# Altium schematic sheet 01_gap_interface.SchDoc: SENSEI Debug Board
size A1; Author: Sebastian Frey; DrawnBy: Sebastian Frey; Engineer: Sebastian Frey; Organization: Integrated System Laboratory; DocumentNumber: 1; Revision: v1.1; SheetNumber: 1; SheetTotal: 1
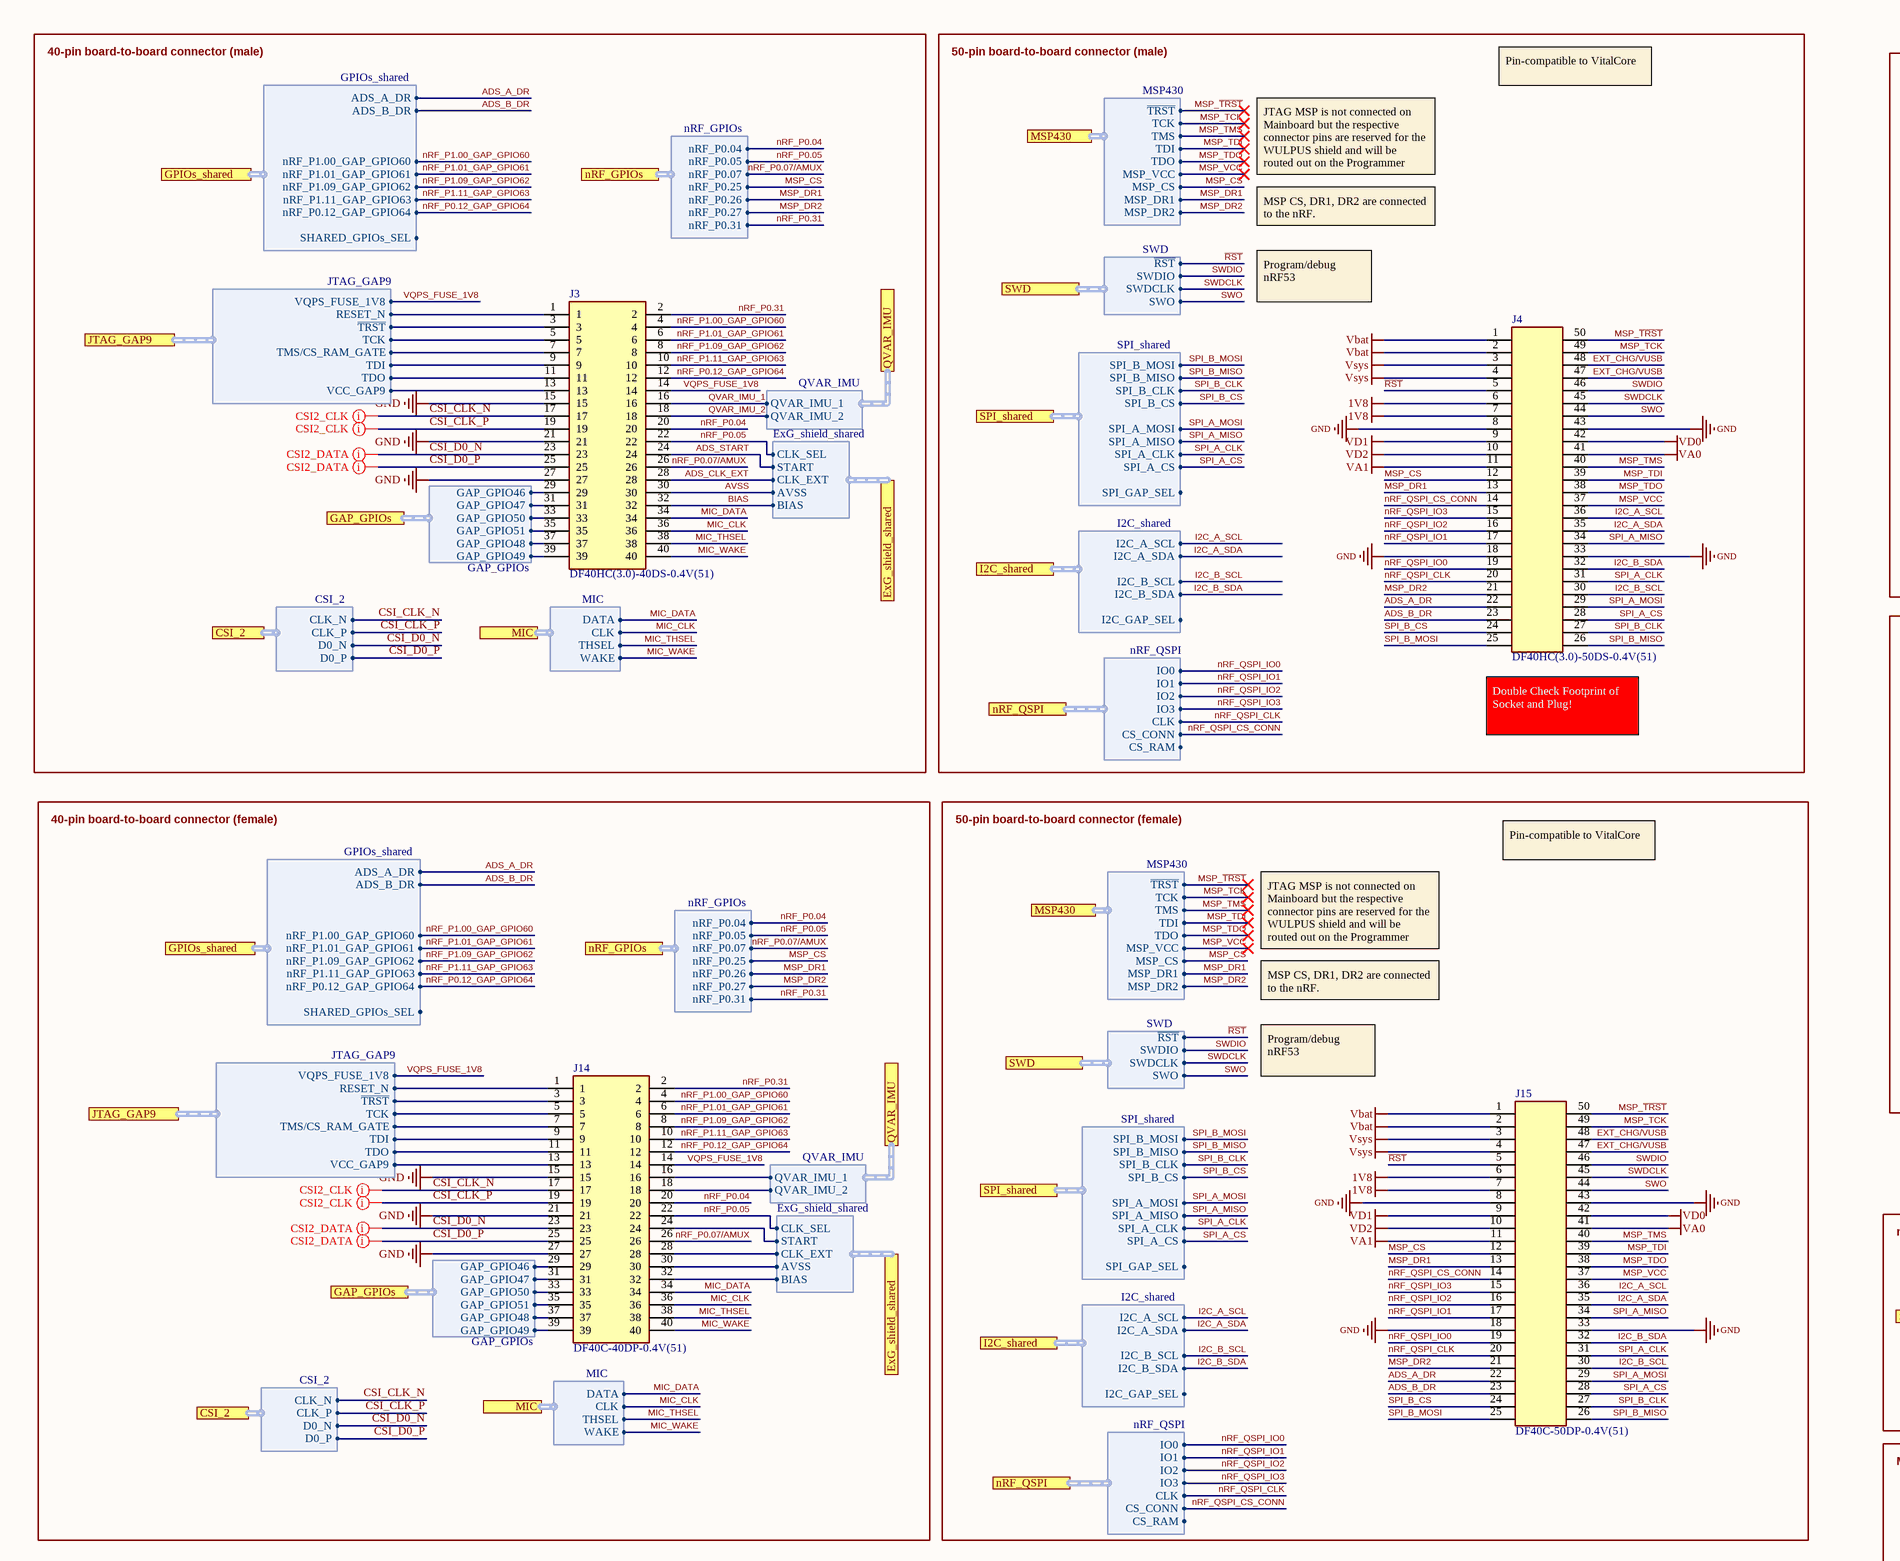
[diagram p0: 01_gap_interface.SchDoc, top left]
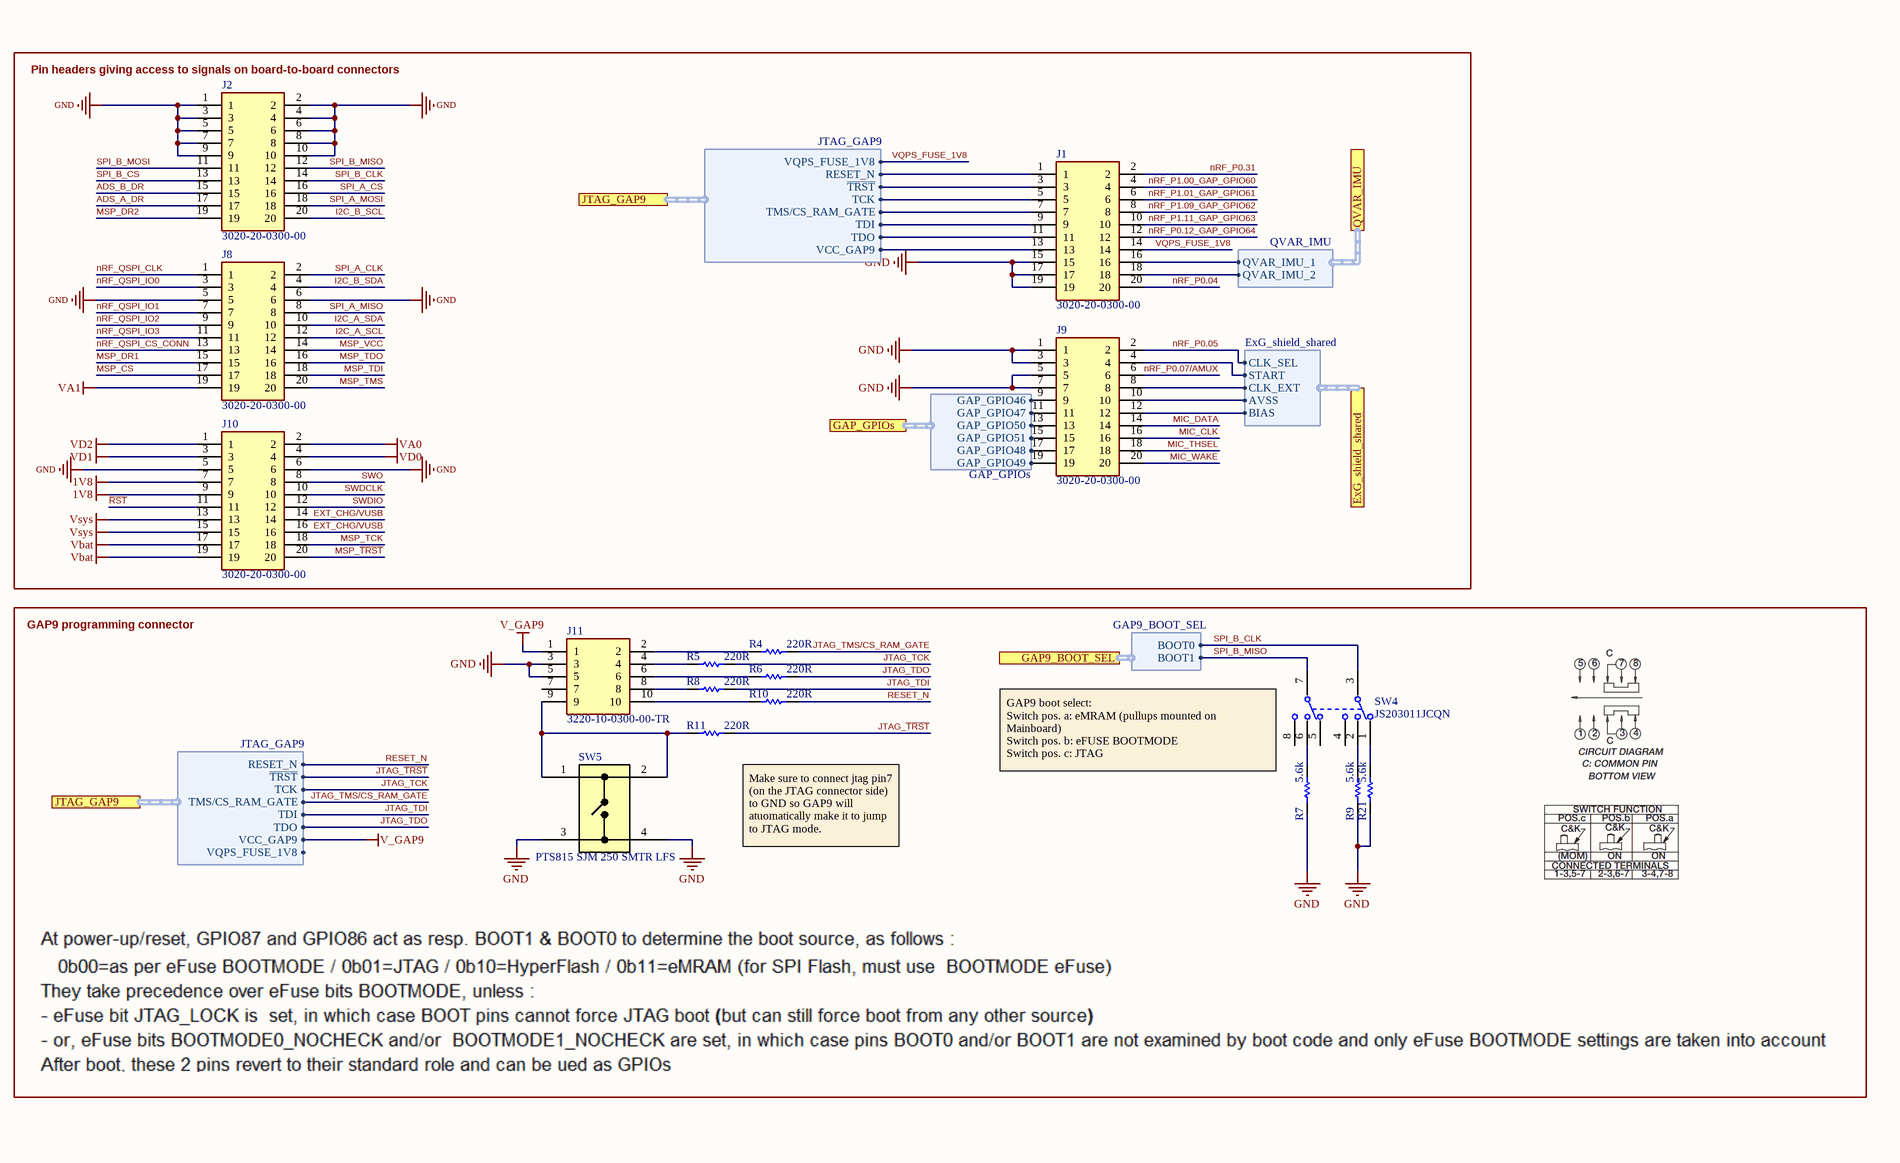
[diagram p1: 01_gap_interface.SchDoc, top right]
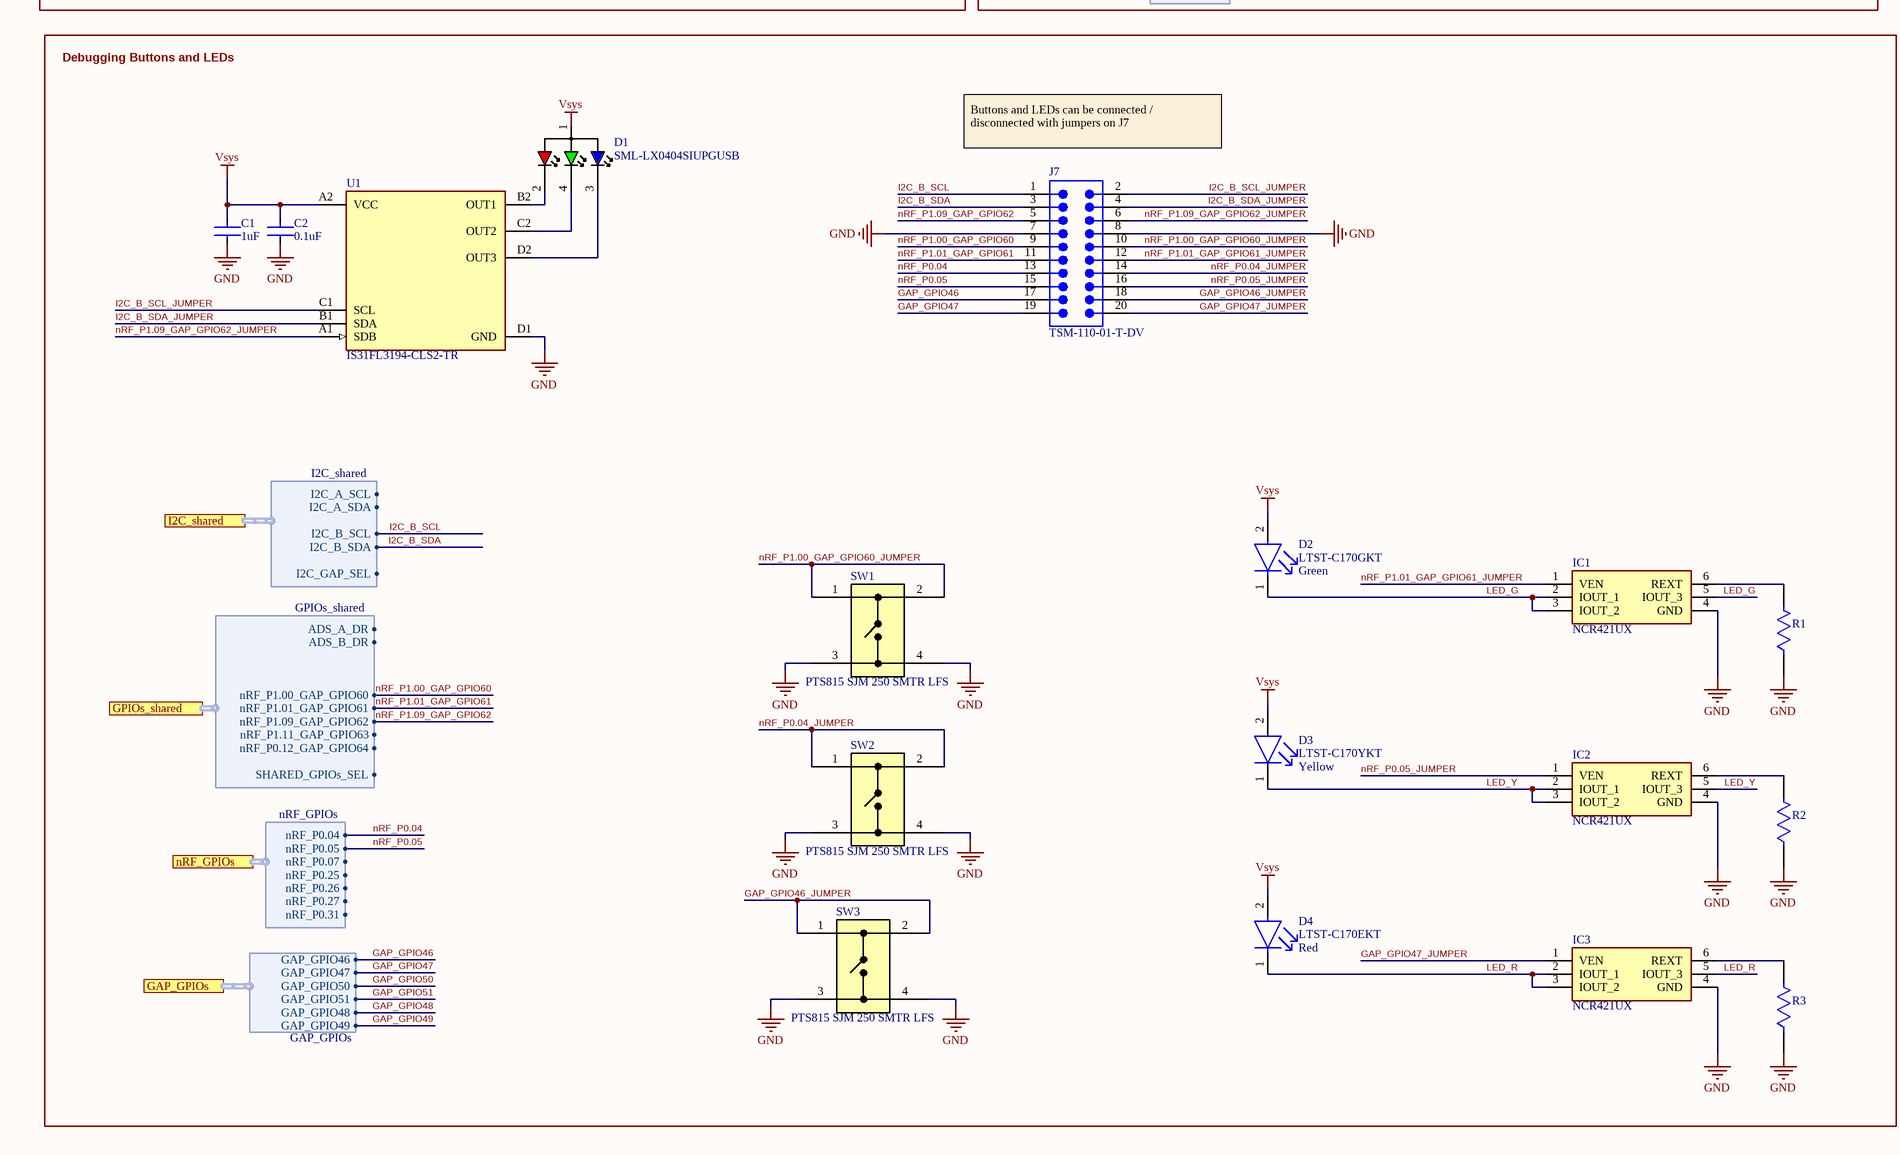
[diagram p2: 01_gap_interface.SchDoc, bottom left]
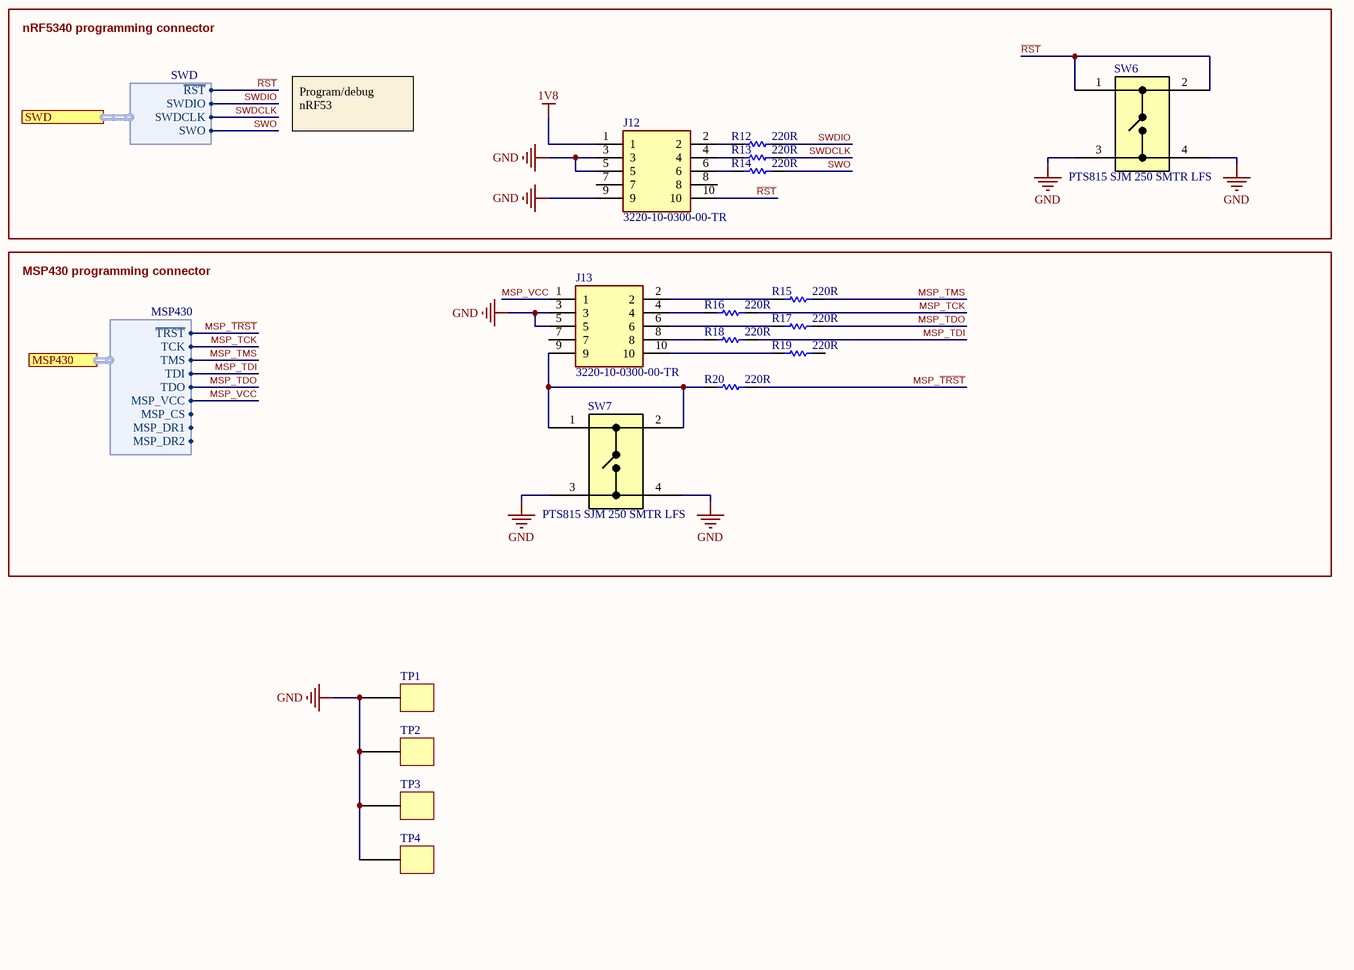
[diagram p3: 01_gap_interface.SchDoc, bottom right]

## Parts
C1  Capacitance: 1uF  [FP-CL511-IPC_C]  (hidden comment: CL05A105KP5NNNC)
C2  Capacitance: 0.1uF  [FP-CL278-IPC_C]  (hidden comment: CL05A104KA5NNNC)
D1  SML-LX0404SIUPGUSB  [SML-LX0404SIUPGUSB]
D2  LTST-C170GKT  Color: Green  [FP-LTST-C170GKT-MFG]
D3  LTST-C170YKT  Color: Yellow  [FP-LTST-C170YKT-MFG]
D4  LTST-C170EKT  Illumination Color: Red  [FP-LTST-C170AKT-MFG]
IC1  NCR421UX  [SOT95P275X110-6N]
IC2  NCR421UX  [SOT95P275X110-6N]
IC3  NCR421UX  [SOT95P275X110-6N]
J1  3020-20-0300-00  [302020030000]
J2  3020-20-0300-00  [302020030000]
J3  DF40HC(3.0)-40DS-0.4V(51)  [DF40HC3040DS04V51]
J4  DF40HC(3.0)-50DS-0.4V(51)  [DF40HC3050DS04V51]
J7  TSM-110-01-T-DV  [SMTC-TSM-110-01-X-DV]
J8  3020-20-0300-00  [302020030000]
J9  3020-20-0300-00  [302020030000]
J10  3020-20-0300-00  [302020030000]
J11  3220-10-0300-00-TR  [322010030000TR]
J12  3220-10-0300-00-TR  [322010030000TR]
J13  3220-10-0300-00-TR  [322010030000TR]
J14  DF40C-40DP-0.4V(51)  [FP-DF40C-40DP-0_4V_51-MFG]
J15  DF40C-50DP-0.4V(51)  [CONN_COMBI_50P]
R1  RR1220Q-680-D  [FP-RR1220-IPC_C]  (value not drawn)
R2  RR1220Q-680-D  [FP-RR1220-IPC_C]  (value not drawn)
R3  RR1220Q-680-D  [FP-RR1220-IPC_C]  (value not drawn)
R4  value 220R  [RESC0603X28X15ML05T05]  (hidden comment: CRCW0201220RFKED)
R5  value 220R  [RESC0603X28X15ML05T05]  (hidden comment: CRCW0201220RFKED)
R6  value 220R  [RESC0603X28X15ML05T05]  (hidden comment: CRCW0201220RFKED)
R7  Resistance: 5.6k  [RESC1608X55X30ML20T10]  (hidden comment: RK73B1JTTD562J)
R8  value 220R  [RESC0603X28X15ML05T05]  (hidden comment: CRCW0201220RFKED)
R9  Resistance: 5.6k  [RESC1608X55X30ML20T10]  (hidden comment: RK73B1JTTD562J)
R10  value 220R  [RESC0603X28X15ML05T05]  (hidden comment: CRCW0201220RFKED)
R11  value 220R  [RESC0603X28X15ML05T05]  (hidden comment: CRCW0201220RFKED)
R12  value 220R  [RESC0603X28X15ML05T05]  (hidden comment: CRCW0201220RFKED)
R13  value 220R  [RESC0603X28X15ML05T05]  (hidden comment: CRCW0201220RFKED)
R14  value 220R  [RESC0603X28X15ML05T05]  (hidden comment: CRCW0201220RFKED)
R15  value 220R  [RESC0603X28X15ML05T05]  (hidden comment: CRCW0201220RFKED)
R16  value 220R  [RESC0603X28X15ML05T05]  (hidden comment: CRCW0201220RFKED)
R17  value 220R  [RESC0603X28X15ML05T05]  (hidden comment: CRCW0201220RFKED)
R18  value 220R  [RESC0603X28X15ML05T05]  (hidden comment: CRCW0201220RFKED)
R19  value 220R  [RESC0603X28X15ML05T05]  (hidden comment: CRCW0201220RFKED)
R20  value 220R  [RESC0603X28X15ML05T05]  (hidden comment: CRCW0201220RFKED)
R21  Resistance: 5.6k  [RESC1608X55X30ML20T10]  (hidden comment: RK73B1JTTD562J)
SW1  PTS815 SJM 250 SMTR LFS  [SW4_PTS815 SJM 250 SMTR LFS_CNK]
SW2  PTS815 SJM 250 SMTR LFS  [SW4_PTS815 SJM 250 SMTR LFS_CNK]
SW3  PTS815 SJM 250 SMTR LFS  [SW4_PTS815 SJM 250 SMTR LFS_CNK]
SW4  JS203011JCQN  [FP-JS203011JCQN-MFG]
SW5  PTS815 SJM 250 SMTR LFS  [SW4_PTS815 SJM 250 SMTR LFS_CNK]
SW6  PTS815 SJM 250 SMTR LFS  [SW4_PTS815 SJM 250 SMTR LFS_CNK]
SW7  PTS815 SJM 250 SMTR LFS  [SW4_PTS815 SJM 250 SMTR LFS_CNK]
TP1  TP THT  [TEST_POINT_KEYSTONE_5007_TRAD]  (value not drawn)
TP2  TP THT  [TEST_POINT_KEYSTONE_5007_TRAD]  (value not drawn)
TP3  TP THT  [TEST_POINT_KEYSTONE_5007_TRAD]  (value not drawn)
TP4  TP THT  [TEST_POINT_KEYSTONE_5007_TRAD]  (value not drawn)
U1  IS31FL3194-CLS2-TR  [WLCSP_8_P0.4]

## Blocks framed on the sheet
40-pin board-to-board connector (male): J3
50-pin board-to-board connector (male): J4
GAP9 programming connector: J11 R4-R11 R21 SW4 SW5
40-pin board-to-board connector (female): J14
50-pin board-to-board connector (female): J15
nRF5340 programming connector: J12 R12-R14 SW6
MSP430 programming connector: J13 R15-R20 SW7
Debugging Buttons and LEDs: C1 C2 D1-D4 IC1-IC3 J7 R1-R3 SW1-SW3 U1

## Ports
CSI_2 (harness CSI_2), ExG_shield_shared (harness ExG_shield_shared), GAP9_BOOT_SEL (harness GAP9_BOOT_SEL), GAP_GPIOs (harness GAP_GPIOs), GPIOs_shared (harness GPIOs_shared), I2C_shared (harness I2C_shared), JTAG_GAP9 (harness JTAG_GAP9), MIC (harness MIC), MSP430 (harness MSP430), nRF_GPIOs (harness nRF_GPIOs), nRF_QSPI (harness nRF_QSPI), QVAR_IMU (harness QVAR_IMU), SPI_shared (harness SPI_shared), SWD (harness SWD)

## Harnesses
QVAR_IMU: QVAR_IMU_2, QVAR_IMU_1
MIC: DATA, THSEL, WAKE, CLK
GAP_GPIOs: GAP_GPIO46, GAP_GPIO47, GAP_GPIO50, GAP_GPIO51, GAP_GPIO48, GAP_GPIO49
GPIOs_shared: ADS_A_DR, ADS_B_DR, nRF_P1.00_GAP_GPIO60, nRF_P1.09_GAP_GPIO62, nRF_P1.11_GAP_GPIO63, nRF_P0.12_GAP_GPIO64, SHARED_GPIOs_SEL, nRF_P1.01_GAP_GPIO61
nRF_GPIOs: nRF_P0.07, nRF_P0.25, nRF_P0.05, nRF_P0.04, nRF_P0.26, nRF_P0.27, nRF_P0.31
CSI_2: CLK_N, CLK_P, D0_P, D0_N
JTAG_GAP9: ~{TRST}, TCK, TMS/CS_RAM_GATE, TDI, TDO, VCC_GAP9, RESET_N, VQPS_FUSE_1V8
SWD: ~{RST}, SWDIO, SWDCLK, SWO
nRF_QSPI: IO0, IO1, IO2, IO3, CLK, CS_CONN, CS_RAM
SPI_shared: SPI_B_MOSI, SPI_B_MISO, SPI_B_CLK, SPI_B_CS, SPI_A_MOSI, SPI_A_MISO, SPI_A_CLK, SPI_A_CS, SPI_GAP_SEL
I2C_shared: I2C_A_SCL, I2C_A_SDA, I2C_B_SCL, I2C_B_SDA, I2C_GAP_SEL
MSP430: ~{TRST}, TCK, TMS, TDI, TDO, MSP_VCC, MSP_DR1, MSP_DR2, MSP_CS
ExG_shield_shared: BIAS, AVSS, CLK_EXT, START, CLK_SEL
GAP9_BOOT_SEL: BOOT0, BOOT1

## Nets
1V8: J4.6 J4.7 J10.7 J10.9 J12.1 J15.6 J15.7
GND: C1.2 C2.2 IC1.4(GND) IC2.4(GND) IC3.4(GND) J1.15 J1.17 J1.19 J2.1 J2.2 J2.3 J2.4 J2.5 J2.6 J2.7 J2.8 J2.9 J2.10 J3.15 J3.21 J3.27 J4.8 J4.18 J4.33 J4.43 J7.7 J7.8 J8.5 J8.6 J9.1 J9.3 J9.5 J9.7 J10.5 J10.6 J11.3 J11.5 J12.3 J12.5 J12.9 J13.3 J13.5 J14.15 J14.21 J14.27 J15.8 J15.18 J15.33 J15.43 R1.1 R2.1 R3.1 R7.1 R9.1 R21.1 SW1.3 SW1.4 SW2.3 SW2.4 SW3.3 SW3.4 SW5.3 SW5.4 SW6.3 SW6.4 SW7.3 SW7.4 TP1.1(TP) TP2.1(TP) TP3.1(TP) TP4.1(TP) U1.D1(GND)
V_GAP9: J1.13 J3.13 J11.1 J14.13 ; port JTAG_GAP9.VCC_GAP9
VA0: J4.41 J10.2 J15.41
VA1: J4.11 J8.19 J15.11
Vbat: J4.1 J4.2 J10.17 J10.19 J15.1 J15.2
VD0: J4.42 J10.4 J15.42
VD1: J4.9 J10.3 J15.9
VD2: J4.10 J10.1 J15.10
Vsys: C1.1 C2.1 D1.1(Common_Anode) D2.2(A) D3.2(A) D4.2(A) J4.3 J4.4 J10.13 J10.15 J15.3 J15.4 U1.A2(VCC)
ADS_A_DR: J2.17 J4.22 J15.22 ; port GPIOs_shared.ADS_A_DR
ADS_B_DR: J2.15 J4.23 J15.23 ; port GPIOs_shared.ADS_B_DR
ADS_CLK_EXT: J3.28 J9.8 J14.28 ; port ExG_shield_shared.CLK_EXT
ADS_START: J3.24 J9.4 J14.24 ; port ExG_shield_shared.START
AVSS: J3.30 J9.10 J14.30 ; port ExG_shield_shared.AVSS
BIAS: J3.32 J9.12 J14.32 ; port ExG_shield_shared.BIAS
CSI_CLK_N: J3.17 J14.17 ; port CSI_2.CLK_N
CSI_CLK_P: J3.19 J14.19 ; port CSI_2.CLK_P
CSI_D0_N: J3.23 J14.23 ; port CSI_2.D0_N
CSI_D0_P: J3.25 J14.25 ; port CSI_2.D0_P
EXT_CHG/VUSB: J4.47 J4.48 J10.14 J10.16 J15.47 J15.48
GAP_GPIO46: J3.29 J7.17 J9.9 J14.29 ; port GAP_GPIOs.GAP_GPIO46
GAP_GPIO46_JUMPER: J7.18 SW3.1 SW3.2
GAP_GPIO47: J3.31 J7.19 J9.11 J14.31 ; port GAP_GPIOs.GAP_GPIO47
GAP_GPIO47_JUMPER: IC3.1(VEN) J7.20
GAP_GPIO48: J3.37 J9.17 J14.37 ; port GAP_GPIOs.GAP_GPIO48
GAP_GPIO49: J3.39 J9.19 J14.39 ; port GAP_GPIOs.GAP_GPIO49
GAP_GPIO50: J3.33 J9.13 J14.33 ; port GAP_GPIOs.GAP_GPIO50
GAP_GPIO51: J3.35 J9.15 J14.35 ; port GAP_GPIOs.GAP_GPIO51
I2C_A_SCL: J4.36 J8.12 J15.36 ; port I2C_shared.I2C_A_SCL
I2C_A_SDA: J4.35 J8.10 J15.35 ; port I2C_shared.I2C_A_SDA
I2C_B_SCL: J2.20 J4.30 J7.1 J15.30 ; port I2C_shared.I2C_B_SCL
I2C_B_SCL_JUMPER: J7.2 U1.C1(SCL)
I2C_B_SDA: J4.32 J7.3 J8.4 J15.32 ; port I2C_shared.I2C_B_SDA
I2C_B_SDA_JUMPER: J7.4 U1.B1(SDA)
JTAG_~{TRST}: J1.3 J3.3 J14.3 R11.2 ; port JTAG_GAP9.~{TRST}
JTAG_TCK: J1.5 J3.5 J14.5 R5.2 ; port JTAG_GAP9.TCK
JTAG_TDI: J1.9 J3.9 J14.9 R8.2 ; port JTAG_GAP9.TDI
JTAG_TDO: J1.11 J3.11 J14.11 R6.2 ; port JTAG_GAP9.TDO
JTAG_TMS/CS_RAM_GATE: J1.7 J3.7 J14.7 R4.2 ; port JTAG_GAP9.TMS/CS_RAM_GATE
LED_G: D2.1(C) IC1.2(IOUT_1) IC1.3(IOUT_2) IC1.5(IOUT_3)
LED_R: D4.1(C) IC3.2(IOUT_1) IC3.3(IOUT_2) IC3.5(IOUT_3)
LED_Y: D3.1(C) IC2.2(IOUT_1) IC2.3(IOUT_2) IC2.5(IOUT_3)
MIC_CLK: J3.36 J9.16 J14.36 ; port MIC.CLK
MIC_DATA: J3.34 J9.14 J14.34 ; port MIC.DATA
MIC_THSEL: J3.38 J9.18 J14.38 ; port MIC.THSEL
MIC_WAKE: J3.40 J9.20 J14.40 ; port MIC.WAKE
MSP_CS: J4.12 J8.17 J15.12 ; port nRF_GPIOs.nRF_P0.25, port MSP430.MSP_CS
MSP_DR1: J4.13 J8.15 J15.13 ; port nRF_GPIOs.nRF_P0.26, port MSP430.MSP_DR1
MSP_DR2: J2.19 J4.21 J15.21 ; port nRF_GPIOs.nRF_P0.27, port MSP430.MSP_DR2
MSP_~{TRST}: J4.50 J10.20 J15.50 R20.2 ; port MSP430.~{TRST}
MSP_TCK: J4.49 J10.18 J15.49 R16.2 ; port MSP430.TCK
MSP_TDI: J4.39 J8.18 J15.39 R18.2 ; port MSP430.TDI
MSP_TDO: J4.38 J8.16 J15.38 R17.2 ; port MSP430.TDO
MSP_TMS: J4.40 J8.20 J15.40 R15.2 ; port MSP430.TMS
MSP_VCC: J4.37 J8.14 J13.1 J15.37 ; port MSP430.MSP_VCC
nRF_P0.04: J1.20 J3.20 J7.13 J14.20 ; port nRF_GPIOs.nRF_P0.04
nRF_P0.04_JUMPER: J7.14 SW2.1 SW2.2
nRF_P0.05: J3.22 J7.15 J9.2 J14.22 ; port nRF_GPIOs.nRF_P0.05, port ExG_shield_shared.CLK_SEL
nRF_P0.05_JUMPER: IC2.1(VEN) J7.16
nRF_P0.07/AMUX: J3.26 J9.6 J14.26 ; port nRF_GPIOs.nRF_P0.07
nRF_P0.12_GAP_GPIO64: J1.12 J3.12 J14.12 ; port GPIOs_shared.nRF_P0.12_GAP_GPIO64
nRF_P0.31: J1.2 J3.2 J14.2 ; port nRF_GPIOs.nRF_P0.31
nRF_P1.00_GAP_GPIO60: J1.4 J3.4 J7.9 J14.4 ; port GPIOs_shared.nRF_P1.00_GAP_GPIO60
nRF_P1.00_GAP_GPIO60_JUMPER: J7.10 SW1.1 SW1.2
nRF_P1.01_GAP_GPIO61: J1.6 J3.6 J7.11 J14.6 ; port GPIOs_shared.nRF_P1.01_GAP_GPIO61
nRF_P1.01_GAP_GPIO61_JUMPER: IC1.1(VEN) J7.12
nRF_P1.09_GAP_GPIO62: J1.8 J3.8 J7.5 J14.8 ; port GPIOs_shared.nRF_P1.09_GAP_GPIO62
nRF_P1.09_GAP_GPIO62_JUMPER: J7.6 U1.A1(SDB)
nRF_P1.11_GAP_GPIO63: J1.10 J3.10 J14.10 ; port GPIOs_shared.nRF_P1.11_GAP_GPIO63
nRF_QSPI_CLK: J4.20 J8.1 J15.20 ; port nRF_QSPI.CLK
nRF_QSPI_CS_CONN: J4.14 J8.13 J15.14 ; port nRF_QSPI.CS_CONN
nRF_QSPI_IO0: J4.19 J8.3 J15.19 ; port nRF_QSPI.IO0
nRF_QSPI_IO1: J4.17 J8.7 J15.17 ; port nRF_QSPI.IO1
nRF_QSPI_IO2: J4.16 J8.9 J15.16 ; port nRF_QSPI.IO2
nRF_QSPI_IO3: J4.15 J8.11 J15.15 ; port nRF_QSPI.IO3
QVAR_IMU_1: J1.16 J3.16 J14.16 ; port QVAR_IMU.QVAR_IMU_1
QVAR_IMU_2: J1.18 J3.18 J14.18 ; port QVAR_IMU.QVAR_IMU_2
~{RST}: J4.5 J10.11 J12.10 J15.5 SW6.1 SW6.2 ; port SWD.~{RST}
RESET_N: J1.1 J3.1 J14.1 R10.2 ; port JTAG_GAP9.RESET_N
SPI_A_CLK: J4.31 J8.2 J15.31 ; port SPI_shared.SPI_A_CLK
SPI_A_CS: J2.16 J4.28 J15.28 ; port SPI_shared.SPI_A_CS
SPI_A_MISO: J4.34 J8.8 J15.34 ; port SPI_shared.SPI_A_MISO
SPI_A_MOSI: J2.18 J4.29 J15.29 ; port SPI_shared.SPI_A_MOSI
SPI_B_CLK: J2.14 J4.27 J15.27 SW4.3(C) ; port SPI_shared.SPI_B_CLK, port GAP9_BOOT_SEL.BOOT0
SPI_B_CS: J2.13 J4.24 J15.24 ; port SPI_shared.SPI_B_CS
SPI_B_MISO: J2.12 J4.26 J15.26 SW4.7(C) ; port SPI_shared.SPI_B_MISO, port GAP9_BOOT_SEL.BOOT1
SPI_B_MOSI: J2.11 J4.25 J15.25 ; port SPI_shared.SPI_B_MOSI
SWDCLK: J4.45 J10.10 J15.45 R13.2 ; port SWD.SWDCLK
SWDIO: J4.46 J10.12 J15.46 R12.2 ; port SWD.SWDIO
SWO: J4.44 J10.8 J15.44 R14.2 ; port SWD.SWO
VQPS_FUSE_1V8: J1.14 J3.14 J14.14 ; port JTAG_GAP9.VQPS_FUSE_1V8
NetD1_2: D1.2(Red_C) U1.B2(OUT1)
NetD1_3: D1.3(Blue_C) U1.D2(OUT3)
NetD1_4: D1.4(Green_C) U1.C2(OUT2)
NetIC1_6: IC1.6(REXT) R1.2
NetIC2_6: IC2.6(REXT) R2.2
NetIC3_6: IC3.6(REXT) R3.2
NetJ11_2: J11.2 R4.1
NetJ11_4: J11.4 R5.1
NetJ11_6: J11.6 R6.1
NetJ11_8: J11.8 R8.1
NetJ11_9: J11.9 R11.1 SW5.1 SW5.2
NetJ11_10: J11.10 R10.1
NetJ12_2: J12.2 R12.1
NetJ12_4: J12.4 R13.1
NetJ12_6: J12.6 R14.1
NetJ13_2: J13.2 R15.1
NetJ13_4: J13.4 R16.1
NetJ13_6: J13.6 R17.1
NetJ13_8: J13.8 R18.1
NetJ13_9: J13.9 R20.1 SW7.1 SW7.2
NetJ13_10: J13.10 R19.1
NetR7_2: R7.2 SW4.6
NetR9_2: R9.2 SW4.2
NetR21_2: R21.2 SW4.1

Not connected (* = marked no-connect by the designer): J11 7; J12 7 8; J13 7; R19 2; SW4 4 5 8

## Layout directives
net class CSI2_CLK: CSI_CLK_N, CSI_CLK_P
net class CSI2_DATA: CSI_D0_N, CSI_D0_P

## Notes on the sheet
- Pin-compatible to VitalCore
- (near J2) Pin headers giving access to signals on board-to-board connectors
- JTAG MSP is not connected on Mainboard but the respective connector pins are reserved for the WULPUS shield and will be routed out on the Programmer PCB.
- MSP CS, DR1, DR2 are connected to the nRF.
- Program/debug nRF53
- (near J4) Double Check Footprint of Socket and Plug!
- GAP9 boot select:
  Switch pos. a: eMRAM (pullups mounted on Mainboard)
  Switch pos. b: eFUSE BOOTMODE
  Switch pos. c: JTAG
- (near R11) Make sure to connect jtag pin7  (on the JTAG connector side) to GND so GAP9 will atuomatically make it to jump to JTAG mode.
- (near J7) Buttons and LEDs can be connected / disconnected with jumpers on J7
- Drawing title:
- Drawing number:
- Rev:
- Format:
- Laboratory:
- Project:
- File:
- Date:
- A2
- Drawn by:
- Page
- of

## Library data of the parts
C1 = CMP-13271-001936-1: Cap Ceramic 1uF 10V X5R ±10% SMD 0402 +85°C Paper T/R; Depth: 0.5mm; Case Code (Imperial): 0402; Material: Ceramic; Mount: Surface Mount; Thickness: 0.022inch; Dielectric: X5R; Radiation Hardening: No; Case/Package: 0402; Length: 1mm; Tolerance: 10%; Max Operating Temperature: 85°C; Package Quantity: 1; Width: 0.02inch; Voltage Rating: 10V; Contact Plating: Tin; Height: 0.5mm; Min Operating Temperature: -55°C; Case Code (Metric): 1005; Packaging: Tape and Reel
C2 = CMP-13271-000728-1: Cap Ceramic 100nF 25V X5R ±10% SMD 0402 +85°C Paper T/R; Package Quantity: 1; Height: 0.5mm; Case Code (Metric): 1005; Thickness: 0.022inch; Mount: Surface Mount; Lead Free: Lead Free; Case Code (Imperial): 0402; Packaging: Tape and Reel; Depth: 0.5mm; Voltage: 25V; Min Operating Temperature: -55°C; Voltage Rating: 25V; Dielectric: X5R; Case/Package: 0402; Tolerance: 10%; Width: 0.02inch; Max Operating Temperature: 85°C; Length: 1mm; Radiation Hardening: No; Voltage Rating (DC): 25V
D1 = D_RGB_LED: SML-LX0404SIUPGUSB RGB LED; Manufacturer: Lumex; Supplier 1: Mouser; Manufacturer Part Number: SML-LX0404SIUPGUSB; Supplier Part Number 1: 696-LX0404SIUPGUSB
D2 = CMP-1674-00002-6: LED GREEN CLEAR SMD; Dominant Wavelength: 569nm; Lens Style: Diffused; Forward Voltage: 2.1V; Number of Elements: 1; Wavelength: 565nm; Luminous Intensity: 6mcd; Test Current: 10mA; Power Dissipation: 100mW; Reverse Voltage: 5V; Forward Current: 30mA; Viewing Angle: 130°; Lens Color: Colorless; Min Operating Temperature: -55°C; Number of Pins: 2; Max Operating Temperature: 85°C; Radiation Hardening: No; Illumination Color: Green; Case Code (Metric): 2012; Lens Transparency: Clear; Case/Package: 0805; Width: 1.25mm; Case Code (Imperial): 0805; Package Quantity: 1; Height: 1.1mm; Depth: 1.25mm; Length: 2mm; Power Rating: 100mW; Lead Free: Lead Free; Number of LEDs: 1; Packaging: Tape and Reel; Mount: Surface Mount; Voltage: 5V
D3 = CMP-1674-00003-7: LED YELLOW CLEAR SMD; Viewing Angle: 130°; Luminous Intensity: 6mcd; Test Current: 10mA; Number of Elements: 1; Forward Current: 20mA; Forward Voltage: 2.1V; Reverse Voltage: 5V; Power Dissipation: 60mW; Lens Style: Diffused; Wavelength: 585nm; Lens Color: Colorless; Dominant Wavelength: 588nm; RoHS Compliant: Yes; Height: 1.1mm; Min Operating Temperature: -55°C; Max Operating Temperature: 85°C; Number of LEDs: 1; Mount: Surface Mount; Radiation Hardening: No; Illumination Color: Yellow; Length: 3.2mm; Series: CHIPLED 0805; Package Quantity: 1; Packaging: Tape and Reel; Depth: 1.6mm; Case/Package: 0805; Lens Transparency: Clear; Case Code (Imperial): 0805; Width: 1.25mm; Case Code (Metric): 2012; Lead Free: Lead Free; Power Rating: 60mW; Number of Pins: 2
D4 = CMP-22017-000022-1: LED RED CLEAR SMD; Number of Elements: 1; Reverse Voltage: 5V; Forward Voltage: 2.1V; Dominant Wavelength: 621nm; Power Dissipation: 100mW; Wavelength: 630nm; Test Current: 10mA; Luminous Intensity: 2mcd; Lens Color: Colorless; Lens Style: Diffused; Forward Current: 30mA; Viewing Angle: 130°; Depth: 1.25mm; Lens Transparency: Clear; Height: 1.1mm; Lead Free: Lead Free; Case Code (Imperial): 0805; Max Power Dissipation: 100mW; Color: Red; Min Operating Temperature: -55°C; Width: 1.25mm; Package Quantity: 1; Max Operating Temperature: 85°C; Case/Package: 0805; Number of LEDs: 1; Number of Pins: 2; Packaging: Tape and Reel; Length: 2mm; Radiation Hardening: No; Mount: Surface Mount; Case Code (Metric): 2012
IC1-IC3 = NCR421UX: Integrated Circuit; Manufacturer_Name: Nexperia; Datasheet Link: https://assets.nexperia.com/documents/data-sheet/NCR420U_NCR421U.pdf; Height: 1.1mm; Manufacturer_Part_Number: NCR421UX; Mouser Part Number: 771-NCR421UX; Mouser Price/Stock: https://www.mouser.co.uk/ProductDetail/Nexperia/NCR421UX?qs=0lSvoLzn4L8cYO%2FeeNZX1Q%3D%3D; Arrow Part Number: NCR421UX; Arrow Price/Stock: https://www.arrow.com/en/products/ncr421ux/nexperia?region=nac
J1 J2 J8-J10 = 3020-20-0300-00: Connector; Manufacturer_Name: CNC Tech; Datasheet Link: http://cnctech.us/pdfs/3020-XX-0300-00.pdf; Height: 9mm; Manufacturer_Part_Number: 3020-20-0300-00; Arrow Part Number: 3020-20-0300-00; Arrow Price/Stock: https://www.arrow.com/en/products/3020-20-0300-00/cnc-tech-llc?region=nac
J3 = DF40HC(3.0)-40DS-0.4V(51): 40 Position 0.4mm Pitch Dual Row Vertical Surface Mount (SMT) Pin Socket, 3.0mm Stacking Height; System: Connector; Package: None; Availability: Unavailable; Value: *; MP: DF40HC(3.0)-40DS-0.4V(51); Price: None
J4 = DF40HC(3.0)-50DS-0.4V(51): 50 Position 0.4mm Pitch Dual Row Vertical Surface Mount (SMT) Pin Socket, 3.0mm Stacking Height; Mfr_Name: Hirose; Copyright: Copyright (C) 2023 Ultra Librarian. All rights reserved.; Manufacturer_Part_Number: DF40HC(3.0)-50DS-0.4V(51); RefDes: RefDes; Type: DEV
J7 = CMP-1024-00282-1: 0.025" SQ Post Header, Surface Mount, Vertical, -55 to 105 degC, 2.54 mm Pitch, 20-Pin, Male, RoHS; Manufacturer: Samtec; Pitch: 2.54 mm; ComponentLink1URL: http://www.samtec.com; ComponentLink2Description: Datasheet; RoHS: True; ComponentLink3URL: http://www.samtec.com/documents/webfiles/cpdf/TSM-1XX-XX-XXX-XX-X-XXX-X-MKT.pdf; ComponentLink1Description: Manufacturer URL; PackageVersion: DJ, 4/1991; DatasheetVersion: F-214; PackageReference: TSM-110-01-X-DV; PackageDescription: Double Row Gullwing ASM; ComponentLink3Description: Package Specification; PartNumber: TSM-110-01-T-DV; Orientation: Vertical; ComponentLink2URL: http://www.samtec.com/documents/webfiles/pdf/TSM.PDF; Mounting Technology: Surface Mount; Temperature Range: -55 to 105 degC
J11-J13 = 3220-10-0300-00-TR: Connector; Manufacturer_Name: CNC Tech; Datasheet Link: http://www.cnctech.us/pdfs/3220-XX-0300-00-TR.pdf; Height: 5.55mm; Manufacturer_Part_Number: 3220-10-0300-00-TR; Arrow Part Number: 3220-10-0300-00-TR; Arrow Price/Stock: https://www.arrow.com/en/products/3220-10-0300-00-tr/cnc-tech-llc?region=nac
J14 = DF40C-40DP-0.4V(51): 50 Position 0.4mm Pitch Dual Row Vertical Surface Mount (SMT) Receptacle; Connector Type: Plug; Number of Contacts: 40; Gender: Male; Voltage Rating: 30V; Mated Stacking Heights: 4mm; Current Rating: 300mA; System: Connector; Lead Free: Lead Free; Number of Positions: 40; Packaging: Tape and Reel; Contact Plating: Gold; REACH SVHC: No SVHC; Mount: Surface Mount; Orientation: Straight; Housing Material: Polymer; Termination: SMD/SMT; Min Operating Temperature: -35°C; Number of Rows: 2; Max Operating Temperature: 85°C; Pitch: 0.4mm; Contact Material: Bronze; Package Quantity: 1
J15 = DF40C-50DP-0.4V(51): 50 Position 0.4mm Pitch Dual Row Vertical Surface Mount (SMT) Receptacle,; Mfr_Name: Hirose; System: Connector; Copyright: Copyright (C) 2023 Ultra Librarian. All rights reserved.; Manufacturer_Part_Number: DF40C-50DP-0.4V(51); RefDes: RefDes; Type: DEV
R1-R3 = CMP-2001-03565-2: 68Ω ±0.5% 0.1W 1/10W Chip Resistor 0805 (2012 Metric) Thin Film; Power Rating: 100mW; Voltage Rating (DC): 100V; Temperature Coefficient: 50ppm/°C; Resistance: 68R; Height: 0.02inch; Package Quantity: 1; Max Operating Temperature: 125°C; Depth: 1.25mm; Mount: Surface Mount; Min Operating Temperature: -55°C; RoHS Compliant: Yes; Case Code (Imperial): 0805; Max Power Dissipation: 100mW; Technology: THIN FILM; Termination: SMD/SMT; Length: 0.079inch; Case/Package: 0805; Case Code (Metric): 2012; Tolerance: 0.5%; Width: 0.049inch; Size Code: 0805; Packaging: Tape and Reel; Resistor Type: Thin Film; Number of Pins: 2; Voltage Rating: 100V; Number of Terminations: 2; Series: RR; Lead Free: Lead Free
R4-R6 R8 R10-R20 = CMP-2004-00982-1: Manufacturer: Vishay Dale; Part Number: CRCW0201220RFKED
R7 R9 R21 = CMP-2000-01007-1: Manufacturer: KOA Speer; Part Number: RK73B1JTTD562J
SW1-SW3 SW5-SW7 = PTS815 SJM 250 SMTR LFS: No Description Available; Mfr_Name: C&K Components; Copyright: Copyright (C) 2023 Ultra Librarian. All rights reserved.; Manufacturer_Part_Number: PTS815 SJM 250 SMTR LFS; RefDes: RefDes; Type: DEV
SW4 = CMP-10038-000016-1: SWITCH SLIDE DP3T 300MA 6V; Actuator Length: 2mm; Electrical Life: 5000Cycles; Actuator Material: Nylon; Switch Function: On-On-On; Actuator Type: Standard; Current Rating: 300mA; Voltage Rating (DC): 6V; Contact Plating: Silver; Throw Configuration: DP3T; Switch Travel: 2mm; Contact Material: Copper Alloy; Max Operating Temperature: 85°C; Min Operating Temperature: -40°C; RoHS Compliant: Yes; Mount: Surface Mount; Packaging: Cut Tape
U1 = IS31FL3194: LED Driver with Programmable Pattern Sequencing 3-Channel 40mA 8-Pin WCSP T/R; Manufacturer: ISSI; Supplier 1: Digi-Key; Manufacturer Part Number: IS31FL3194-CLS2-TR; Supplier Part Number 1: 2521-IS31FL3194-CLS2-TRCT-ND